# EAGLE board citizen_science_flora_RP2040 (EAGLE 9.6.2)
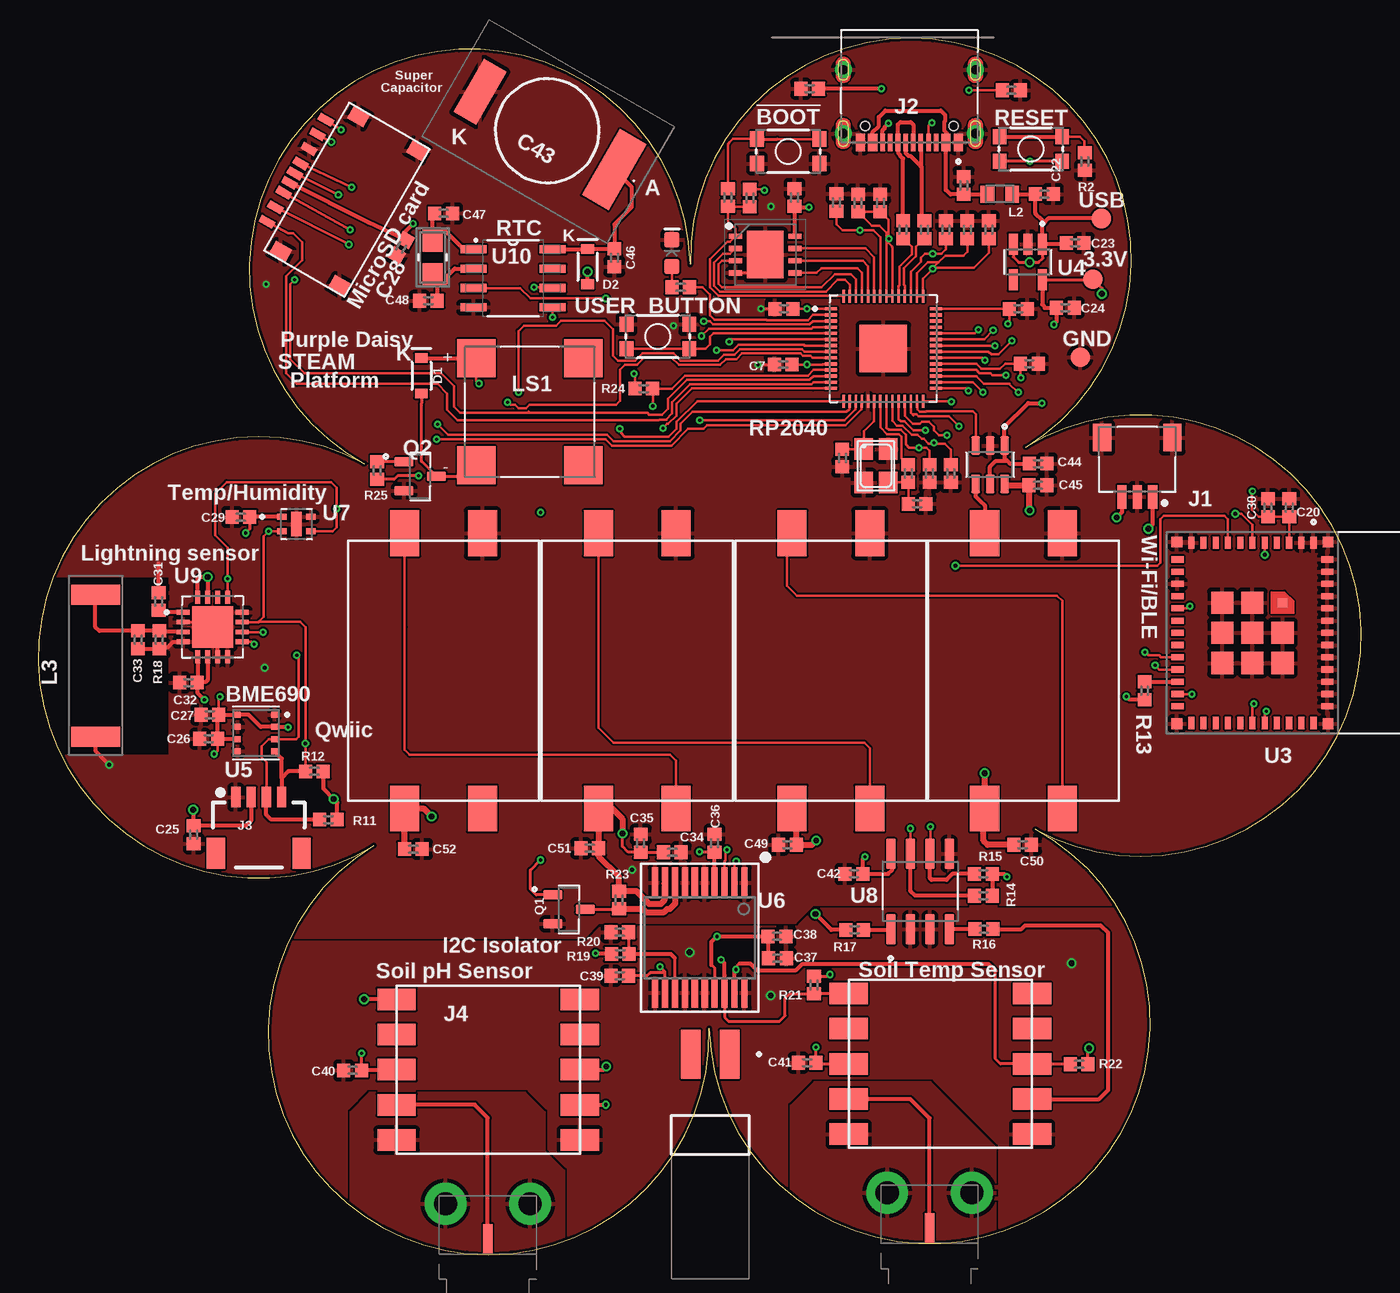
[diagram p4: board, top side]
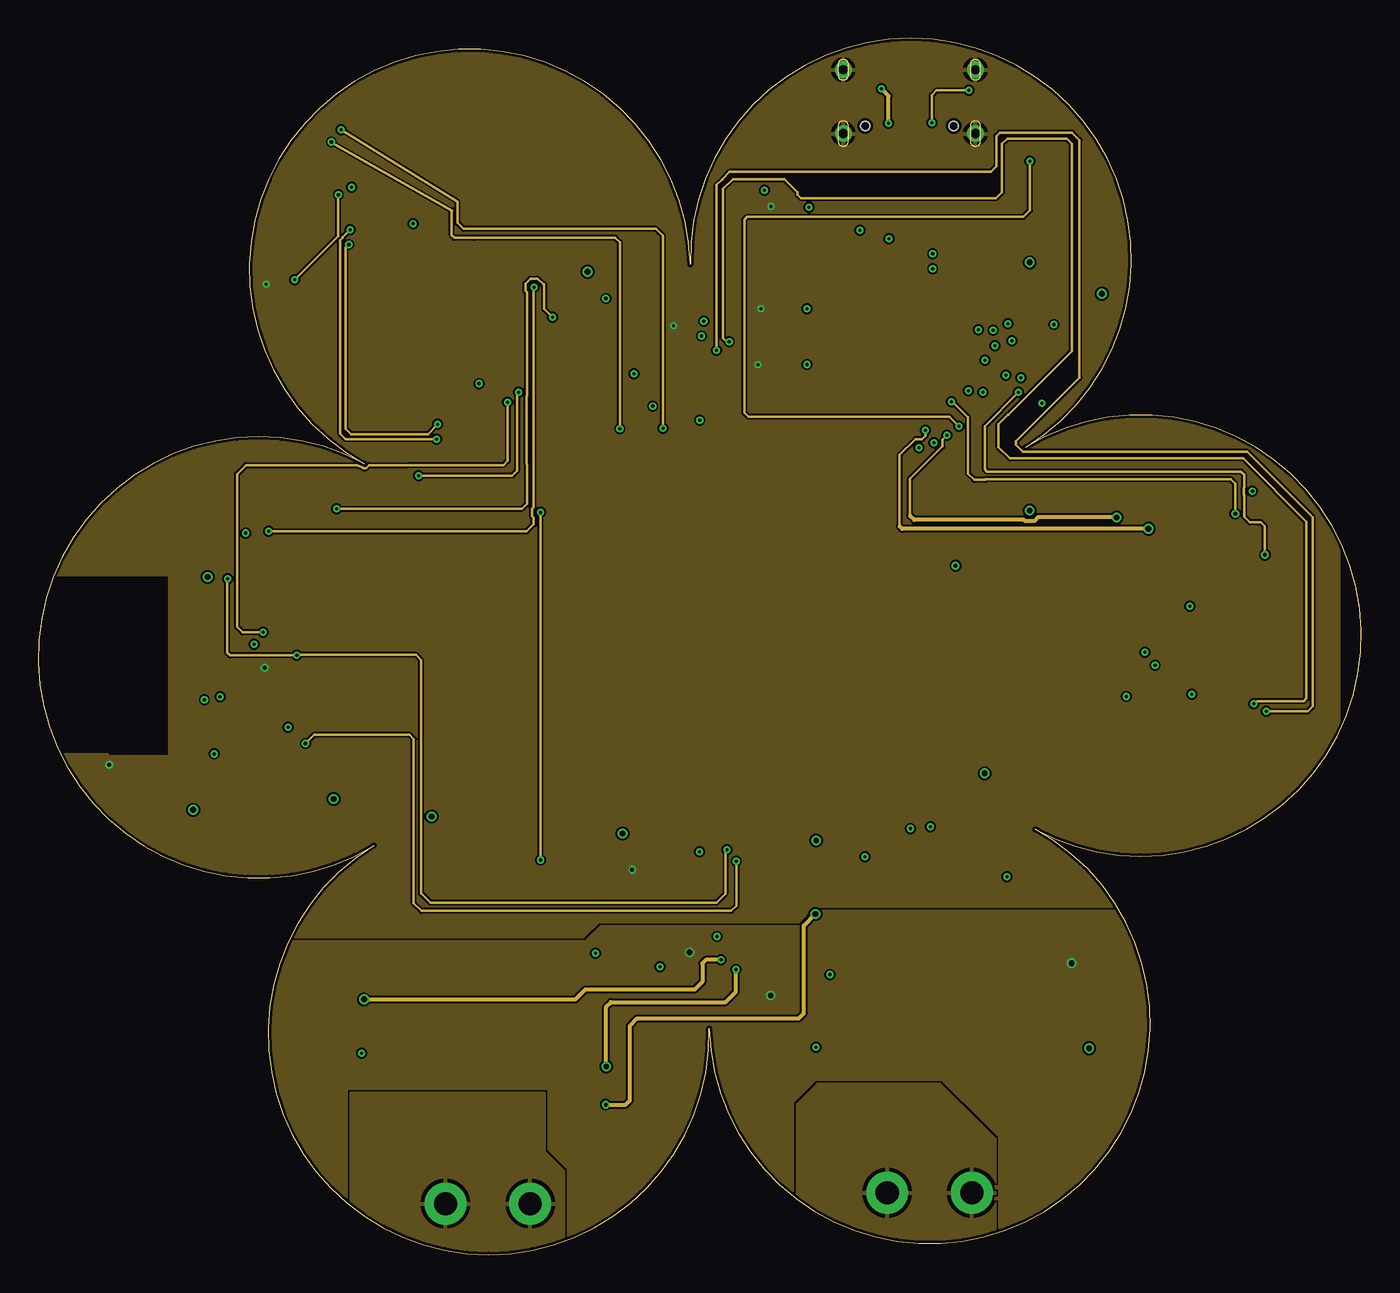
[diagram p5: board, inner layer Route2]
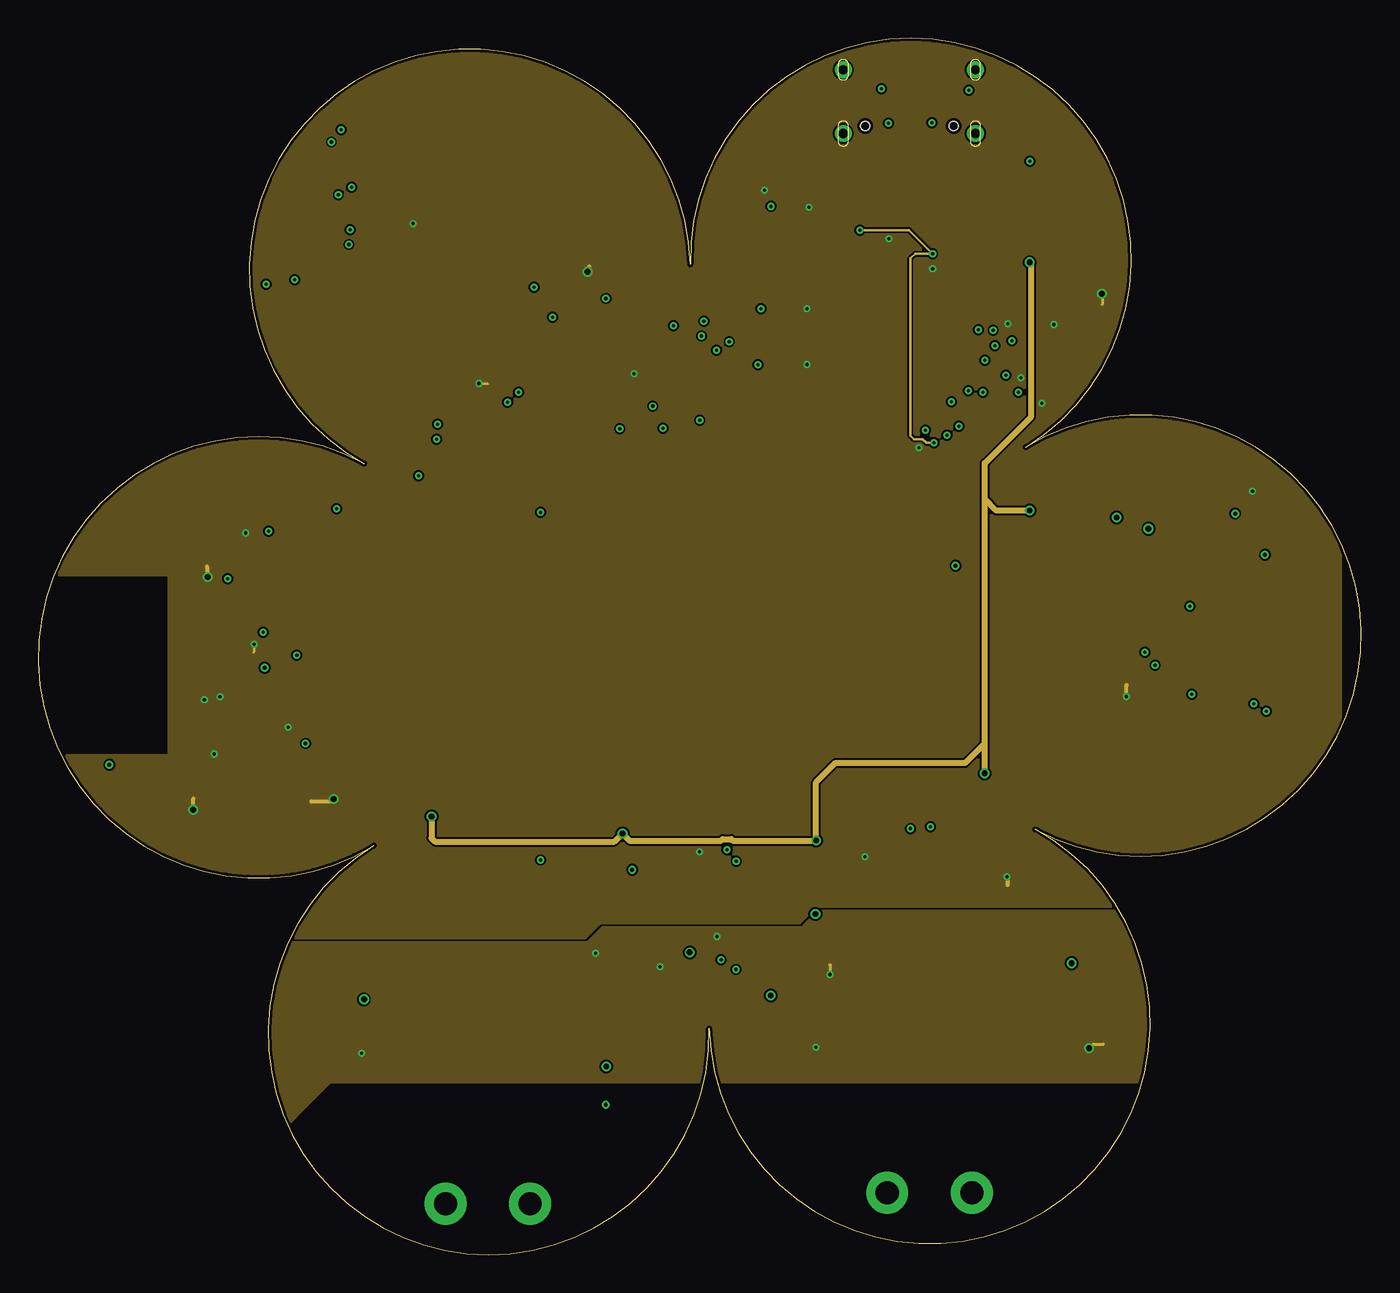
[diagram p6: board, inner layer Route15]
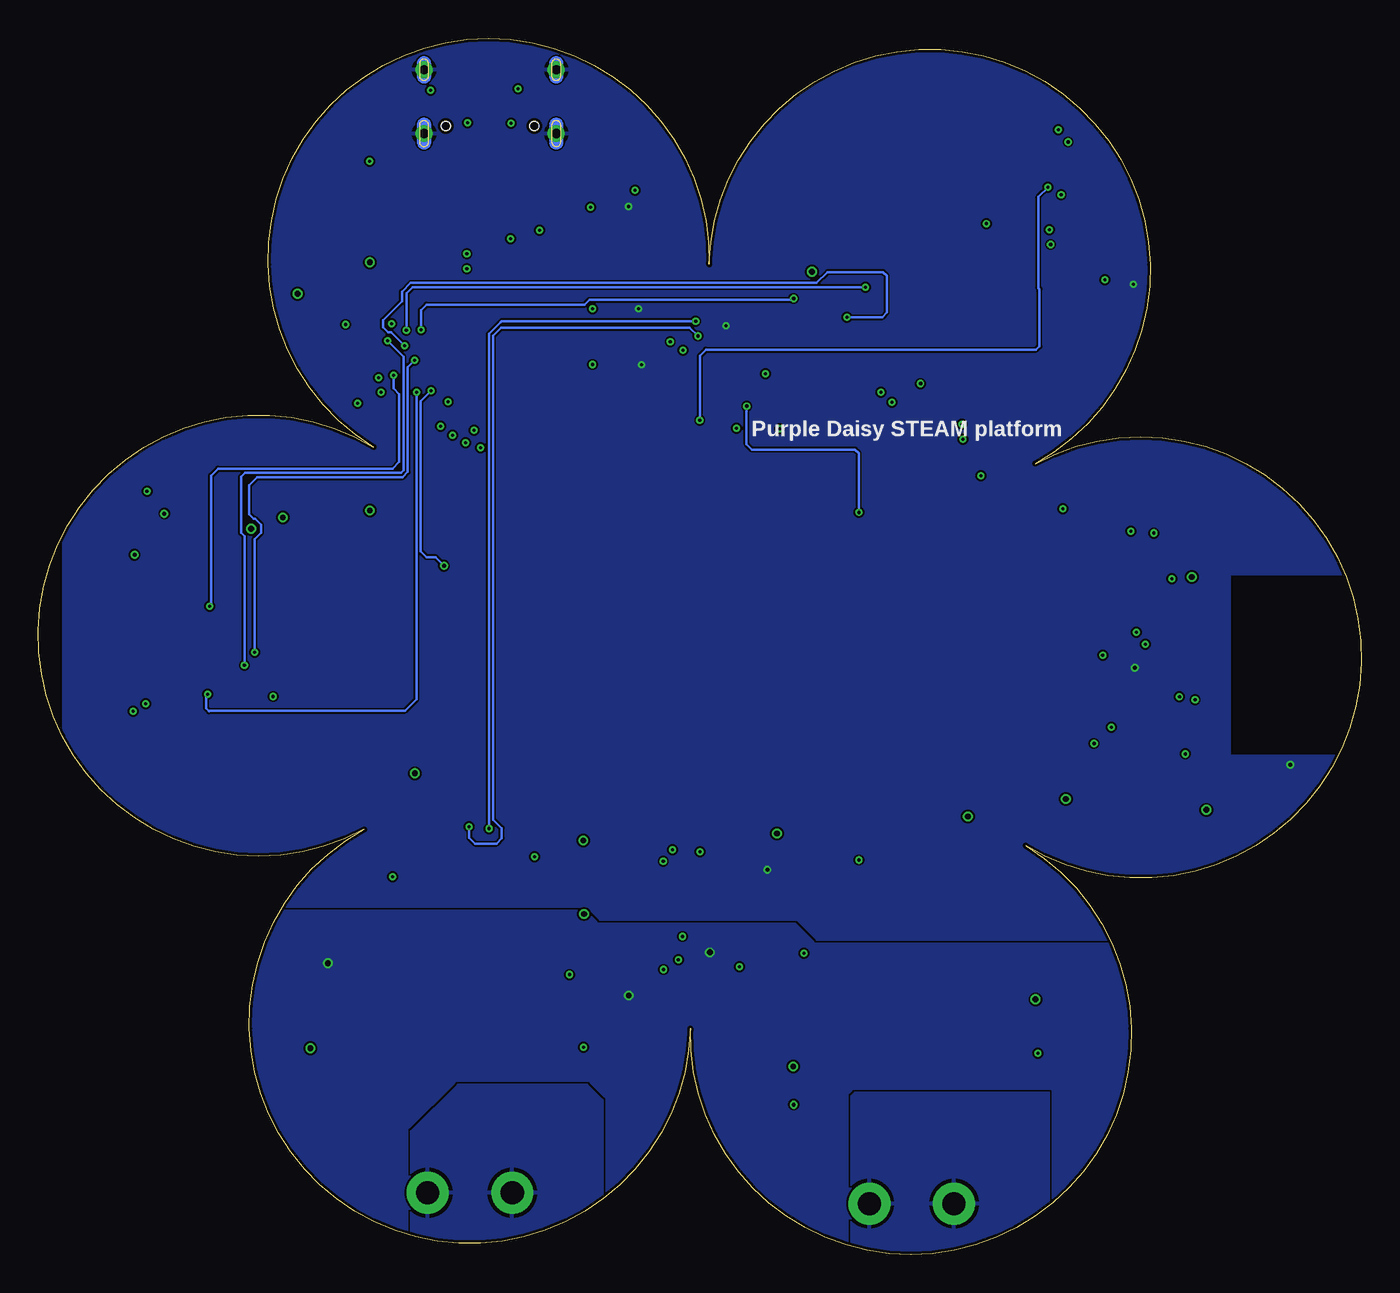
[diagram p7: board, bottom side, seen from below]

Size 86.58 x 79.57 mm. Coordinates in mm from the lower left corner, seen from the top.
Outline: 42.67,64.78 arc240 21.34,51.74 arc240 21.95,26.75 arc240 43.91,14.79 arc240 65.24,27.82 arc240 64.62,52.82 arc240 42.67,64.78
Copper layers (1+2*15+16): Top 0.035mm / dielectric 0.2mm / Route2 0.0175mm / dielectric 1.065mm / Route15 0.0175mm / dielectric 0.2mm / Bottom 0.035mm
Design rules "jlcpcb-4layers": minimum track width 3.5mil, minimum drill 0.2mm, track to track 5mil, track to pad 0.2mm, pad to pad 5mil, via to via 0.5mm, smd to smd 5mil, copper to edge 0.2mm, drill to drill 6mil, minimum pad ring 10mil, minimum via ring 0.13mm, stop-mask expansion 0.05mm, vias tented up to drill 16mil, thermal gap 10mil

## Footprints (pad centres in the part's own frame; a part is rotated, then mirrored left to right if it is on the bottom)
B1,27 = smd 1.27 x 1.27: TP 0,0
TACTILE_SWITCH_SMD_4.6X2.8MM = smd 0.9 x 1: 1 -2.05,-0.8; 2 2.05,-0.8; 3 2.05,0.8; 4 -2.05,0.8
0402 = smd 0.85 x 0.9: 1 -0.58,0; 2 0.58,0
RSCSK2043R3D01004T = smd 5 x 2: 1 0,5.075 | smd 4 x 1.7: 2 0,-5.075
SOD-323 = smd 0.63 x 0.83: A 1.15,0; C -1.15,0
LED-0603 = smd 1 x 1: A -0.877,0; C 0.877,0
SON80P400X400X50-9N = smd 0.85 x 0.35: 1 -1.95,1.2; 2 -1.95,0.4; 3 -1.95,-0.4; 4 -1.95,-1.2; 5 1.95,-1.2; 6 1.95,-0.4; 7 1.95,0.4; 8 1.95,1.2 | smd 2.4 x 3.1: 9 0,0
JST_SM03B-SRSS-TB(LF)(SN) = smd 0.6 x 1.55: 1 -1,0; 2 0,0; 3 1,0 | smd 1.2 x 1.8: S1 -2.3,-3.875; S2 2.3,-3.875
HRO_TYPE-C-31-M-12 = smd 0.6 x 1.14: A1_B12 -3.2,4.75; A4_B9 -2.4,4.75; B1_A12 3.2,4.75; B4_A9 2.4,4.75 | smd 0.3 x 1.14: A5 -1.25,4.75; A6 -0.25,4.75; A7 0.25,4.75; A8 1.25,4.75; B5 1.75,4.75; B6 0.75,4.75; B7 -0.75,4.75; B8 -1.75,4.75 | drill 0.6 pad 0.9: S1 -4.325,4.17; S2 4.325,4.17; S3 -4.325,0; S4 4.325,0 | hole 0.6: -2.89,3.68; 2.89,3.68
1X04_1MM_RA = smd 0.6 x 1.35: 1 -1.5,0; 2 -0.5,0; 3 0.5,0; 4 1.5,0 | smd 1.2 x 2: NC1 2.8,-3.675; NC2 -2.8,-3.675
60312202114511 = smd 0.61 x 1.97: 1 0,-2.325 | drill 1.52: 2 -2.77,0; 3 2.77,0
SAMTEC_TSM-102-02-S-SH = smd 1.27 x 3.18: 01 -1.27,-5.28; 02 1.27,-5.28
INDC1608X100N = smd 0.89 x 1.11: 1 -0.814,0; 2 0.814,0
MA5532-AE = smd 1.3 x 3.2: 1 -4.65,0; 2 4.65,0
XDCR_CMT-8504-100-SMT-TR = smd 2.5 x 2.5: 1 3.5,3.5; 2 3.5,-3.5; N -3.5,-3.5; P -3.5,3.5
SOT95P240X111-3N = smd 1.23 x 0.6: 1 -1.06,0.95; 2 -1.06,-0.95; 3 1.06,0
NX3225 = smd 1.4 x 1.2: 1 -1.1,-0.8; 2 1.1,-0.8; 3 1.1,0.8; 4 -1.1,0.8
QFN40P700X700X90-57N = smd 0.84 x 0.2: 1 -3.435,2.6; 2 -3.435,2.2; 3 -3.435,1.8; 4 -3.435,1.4; 5 -3.435,1; 6 -3.435,0.6; 7 -3.435,0.2; 8 -3.435,-0.2; 9 -3.435,-0.6; 10 -3.435,-1; 11 -3.435,-1.4; 12 -3.435,-1.8; 13 -3.435,-2.2; 14 -3.435,-2.6; 29 3.435,-2.6; 30 3.435,-2.2; 31 3.435,-1.8; 32 3.435,-1.4; 33 3.435,-1; 34 3.435,-0.6; 35 3.435,-0.2; 36 3.435,0.2; 37 3.435,0.6; 38 3.435,1; 39 3.435,1.4; 40 3.435,1.8; 41 3.435,2.2; 42 3.435,2.6 | smd 0.2 x 0.84: 15 -2.6,-3.435; 16 -2.2,-3.435; 17 -1.8,-3.435; 18 -1.4,-3.435; 19 -1,-3.435; 20 -0.6,-3.435; 21 -0.2,-3.435; 22 0.2,-3.435; 23 0.6,-3.435; 24 1,-3.435; 25 1.4,-3.435; 26 1.8,-3.435; 27 2.2,-3.435; 28 2.6,-3.435; 43 2.6,3.435; 44 2.2,3.435; 45 1.8,3.435; 46 1.4,3.435; 47 1,3.435; 48 0.6,3.435; 49 0.2,3.435; 50 -0.2,3.435; 51 -0.6,3.435; 52 -1,3.435; 53 -1.4,3.435; 54 -1.8,3.435; 55 -2.2,3.435; 56 -2.6,3.435 | smd 3.1 x 3.1: 57 0,0
XCVR_ESP32-C3-MINI-1-N4 = smd 0.8 x 0.4: 1 -5.9,1.3; 2 -5.9,0.5; 3 -5.9,-0.3; 4 -5.9,-1.1; 5 -5.9,-1.9; 6 -5.9,-2.7; 7 -5.9,-3.5; 8 -5.9,-4.3; 9 -5.9,-5.1; 10 -5.9,-5.9; 11 -5.9,-6.7; 25 5.9,-6.7; 26 5.9,-5.9; 27 5.9,-5.1; 28 5.9,-4.3; 29 5.9,-3.5; 30 5.9,-2.7; 31 5.9,-1.9; 32 5.9,-1.1; 33 5.9,-0.3; 34 5.9,0.5; 35 5.9,1.3 | smd 0.4 x 0.8: 12 -4.8,-7.6; 13 -4,-7.6; 14 -3.2,-7.6; 15 -2.4,-7.6; 16 -1.6,-7.6; 17 -0.8,-7.6; 18 0,-7.6; 19 0.8,-7.6; 20 1.6,-7.6; 21 2.4,-7.6; 22 3.2,-7.6; 23 4,-7.6; 24 4.8,-7.6; 36 4.8,2.2; 37 4,2.2; 38 3.2,2.2; 39 2.4,2.2; 40 1.6,2.2; 41 0.8,2.2; 42 0,2.2; 43 -0.8,2.2; 44 -1.6,2.2; 45 -2.4,2.2; 46 -3.2,2.2; 47 -4,2.2; 48 -4.8,2.2 | smd 0.6 x 0.6: 49_1 -1.975,-0.725 | smd 1.45 x 1.45: 49_2 0,-0.725; 49_3 1.975,-0.725; 49_4 1.975,-2.7; 49_5 1.975,-4.675; 49_6 0,-4.675; 49_7 -1.975,-4.675; 49_8 -1.975,-2.7; 49_9 0,-2.7 | smd 0.7 x 0.7: 50 5.95,2.25; 51 5.95,-7.65; 52 -5.95,-7.65; 53 -5.95,2.25
SOT95P280X145-5N = smd 1.39 x 0.58: 1 -1.165,0.95; 2 -1.165,0; 3 -1.165,-0.95; 4 1.165,-0.95; 5 1.165,0.95
IC_BME688 = smd 0.4 x 0.4: 1 1.2,1.2; 2 1.2,0.4; 3 1.2,-0.4; 4 1.2,-1.2; 5 -1.2,-1.2; 6 -1.2,-0.4; 7 -1.2,0.4; 8 -1.2,1.2
SSOP20 = smd 0.4 x 2: P1 -2.925,-3.6; P2 -2.275,-3.6; P3 -1.625,-3.6; P4 -0.975,-3.6; P5 -0.325,-3.6; P6 0.325,-3.6; P7 0.975,-3.6; P8 1.625,-3.6; P9 2.275,-3.6; P10 2.925,-3.6; P11 2.925,3.6; P12 2.275,3.6; P13 1.625,3.6; P14 0.975,3.6; P15 0.325,3.6; P16 -0.325,3.6; P17 -0.975,3.6; P18 -1.625,3.6; P19 -2.275,3.6; P20 -2.925,3.6
XDCR_ENS210-LQFM = smd 0.6 x 0.4: 1 -0.95,0.475; 2 -0.95,-0.475; 3 0.95,-0.475; 4 0.95,0.475 | smd 0.7 x 1.6: 5 0,0
SOIC127P599X175-8N = smd 1.97 x 0.6: 1 -2.47,1.905; 2 -2.47,0.635; 3 -2.47,-0.635; 4 -2.47,-1.905; 5 2.47,-1.905; 6 2.47,-0.635; 7 2.47,0.635; 8 2.47,1.905
QFN65P400X400X80-17N = smd 0.84 x 0.32: 1 -1.935,0.975; 2 -1.935,0.325; 3 -1.935,-0.325; 4 -1.935,-0.975; 9 1.935,-0.975; 10 1.935,-0.325; 11 1.935,0.325; 12 1.935,0.975 | smd 0.32 x 0.84: 5 -0.975,-1.935; 6 -0.325,-1.935; 7 0.325,-1.935; 8 0.975,-1.935; 13 0.975,1.935; 14 0.325,1.935; 15 -0.325,1.935; 16 -0.975,1.935 | smd 2.7 x 2.7: 17 0,0
SOIC127P600X175-8N = smd 1.702 x 0.533: 1 -2.591,1.905; 2 -2.591,0.635; 3 -2.591,-0.635; 4 -2.591,-1.905; 5 2.591,-1.905; 6 2.591,-0.635; 7 2.591,0.635; 8 2.591,1.905
OPS-S56AAF5 = smd 1.9 x 3: P$1 -2.54,-9; P$2 2.54,-9; P$3 2.54,9; P$4 -2.54,9
SOT95P280X145-6N = smd 1.21 x 0.58: 1 -1.255,0.95; 2 -1.255,0; 3 -1.255,-0.95; 4 1.255,-0.95; 5 1.255,0; 6 1.255,0.95
MICROSDCARD = smd 0.5 x 1: G1 0.2,0; P1 3.85,0; P2 2.75,0; P3 1.65,0; P4 0.9,0; P5 -0.55,0; P6 -1.65,0; P7 -2.75,0; P8 -3.85,0 | smd 0.95 x 1.2: P$1 -5.1,1.75; P$2 -5.1,6.2; P$3 5.1,6.2; P$4 5.1,1.75
PH_SENSOR = smd 2.5 x 1.4: P$1 -6,4.6; P$2 -6,2.3; P$3 -6,0; P$4 -6,-2.3; P$5 -6,-4.6; P$6 6,-4.6; P$7 6,-2.3; P$8 6,0; P$9 6,2.3; P$10 6,4.6
XTAL_FC-135_EPS = smd 1.422 x 1.295: 1 -1.092,0; 2 1.092,0

## Placement (x,y rotation side)
3.3V  TPB1,27  [B1,27]  69.02,63.81 0 top
!BOOT  MOMENTARY-SWITCH-SPST-SMD-4.6X2.8MM  [TACTILE_SWITCH_SMD_4.6X2.8MM]  49.08,72.17 0 top
C1  0.1uF  [0402]  59.72,51.09 270 top
C2  0.1uF  [0402]  52.23,68.82 90 top
C3  1.0uF  [0402]  59.39,67.04 90 top
C4  1.0uF  [0402]  60.79,67.04 90 top
C5  0.1uF  [0402]  48.8,61.86 180 top
C6  0.1uF  [0402]  62.21,67.04 90 top
C7  0.1uF  [0402]  48.75,58.22 180 top
C8  0.1uF  [0402]  64.14,61.86 0 top
C9  0.1uF  [0402]  64.85,58.27 0 top
C10  0.1uF  [0402]  53.65,68.79 90 top
C11  0.1uF  [0402]  58.32,51.09 270 top
C12  12pF  [0402]  57.51,49.1 180 top
C13  12pF  [0402]  52.61,52.1 90 top
C14  0.1uF  [0402]  55.1,68.79 90 top
C17  0.1uF  [0402]  49.49,69.15 270 top
C20  10UF0402  [0402]  81.87,48.85 90 top
C21  0.1uF  [0402]  60.56,69.93 90 top
C22  0.1uF  [0402]  65.84,69.37 0 top
C23  10UF0402  [0402]  67.85,66.17 180 top
C24  10UF0402  [0402]  67.21,61.93 180 top
C25  0.1uF  [0402]  10.17,27.46 270 top
C26  0.1uF  [0402]  11.16,33.74 180 top
C27  0.1uF  [0402]  11.23,35.31 180 top
C28  0.1uF  [0402]  23.76,65.87 240 top
C29  0.1uF  [0402]  13.27,48.24 180 top
C30  0.1uF  [0402]  80.47,48.85 90 top
C31  10UF0402  [0402]  7.88,42.73 90 top
C32  1.0uF  [0402]  9.84,37.42 180 top
C33  1nF  [0402]  6.53,40.21 270 top
C34  0.1uF  [0402]  41.48,26.32 180 top
C35  10UF0402  [0402]  39.43,26.91 270 top
C36  0.1uF  [0402]  44.25,26.91 270 top
C37  10UF0402  [0402]  48.37,19.39 0 top
C38  0.1uF  [0402]  48.34,20.81 0 top
C39  0.1uF  [0402]  38.06,18.24 180 top
C40  0.1uF  [0402]  20.58,12.05 0 top
C41  0.1uF  [0402]  50.32,12.55 0 top
C42  0.1uF  [0402]  53.37,24.9 0 top
C43  RSCSK2043R3D01004T  [RSCSK2043R3D01004T]  33.31,73.51 240 top
C44  0.1uF  [0402]  65.44,51.75 180 top
C45  0.1uF  [0402]  65.41,50.32 0 top
C46  0.1uF  [0402]  37.7,65.21 270 top
C47  12pF  [0402]  26.52,68.1 180 top
C48  12pF  [0402]  25.53,62.39 0 top
C49  0.1uF  [0402]  49.03,26.8 180 top
C50  0.1uF  [0402]  64.42,26.8 0 top
C51  0.1uF  [0402]  36.1,26.58 180 top
C52  0.1uF  [0402]  24.54,26.52 0 top
D1  1N4148  [SOD-323]  25.08,57.49 270 top
D2  1N5819  [SOD-323]  35.95,64.62 270 top
D3  [LED-0603]  41.46,65.51 90 top
GND  TPB1,27  [B1,27]  68.18,58.71 0 top
IC1  W25Q64JVXGIQ  [SON80P400X400X50-9N]  47.58,65.41 0 top
J1  SM03B-SRSS-TB(LF)(SN)  [JST_SM03B-SRSS-TB(LF)(SN)]  71.91,49.56 180 top
J2  TYPE-C-31-M-12  [HRO_TYPE-C-31-M-12]  57,77.5 180 top
J3  [1X04_1MM_RA]  14.43,29.93 0 top
J4  60312202114511  [60312202114511]  29.42,3.33 0 top
J5  60312202114511  [60312202114511]  58.32,4.05 0 top
J6  TSM-102-02-S-SH  [SAMTEC_TSM-102-02-S-SH]  43.97,7.83 180 top
L2  LQW18AN2N2D10D  [INDC1608X100N]  62.92,69.37 0 top
L3  MA5532-AE  [MA5532-AE]  3.77,38.51 90 top
LS1  MLT-8530  [XDCR_CMT-8504-100-SMT-TR]  32.16,55.12 0 top
Q1  BSS138  [SOT95P240X111-3N]  34.73,22.59 0 top
Q2  BSS138  [SOT95P240X111-3N]  25,50.91 0 top
Q3  [NX3225]  54.82,51.59 270 top
R1  27OHM0402  [0402]  57.99,67.04 90 top
R2  1K  [0402]  68.48,71.51 270 top
R3  27OHM0402  [0402]  56.6,67.04 90 top
R4  100OHM  [0402]  42.04,63.28 180 top
R5  DNF  [0402]  46.56,69.12 90 top
R6  1K  [0402]  45.14,69.15 270 top
R7  1KOHM-0402-1/16W-1%  [0402]  56.93,51.09 90 top
R9  5.1k  [0402]  50.48,76.26 0 top
R10  5.1k  [0402]  63.68,76.16 180 top
R11  DNF  [0402]  18.98,28.45 0 top
R12  2.2K  [0402]  18.07,31.6 0 top
R13  10k  [0402]  72.4,36.89 270 top
R14  1K  [0402]  61.86,23.48 0 top
R15  1K  [0402]  61.86,24.9 0 top
R16  100OHM  [0402]  61.88,21.29 180 top
R17  100OHM  [0402]  53.42,21.24 0 top
R18  10k  [0402]  7.93,40.21 90 top
R19  16.9K  [0402]  38.08,19.67 180 top
R20  10k  [0402]  38.06,21.09 0 top
R21  2.2K  [0402]  50.76,17.63 90 top
R22  2.2K  [0402]  68.1,12.45 0 top
R23  1M  [0402]  38,23.2 90 top
R24  1M  [0402]  39.63,56.65 180 top
R25  470  [0402]  22.18,51.29 270 top
RESET  MOMENTARY-SWITCH-SPST-SMD-4.6X2.8MM  [TACTILE_SWITCH_SMD_4.6X2.8MM]  64.95,72.32 0 top
U1  RP2040  [QFN40P700X700X90-57N]  55.3,59.26 0 top
U3  ESP32-C3-MINI-1-N4  [XCVR_ESP32-C3-MINI-1-N4]  82.15,40.67 270 top
U4  MIC5504-3.3YM5-T5  [SOT95P280X145-5N]  64.75,64.93 270 top
U5  BME690  [IC_BME688]  14.26,34.12 0 top
U6  ADM3260ARSZ  [SSOP20]  43.29,20.73 180 top
U7  ENS210-LQFM  [XDCR_ENS210-LQFM]  16.9,47.78 0 top
U8  SFH6325-X017TEL0631  [SOIC127P599X175-8N]  57.72,23.76 90 top
U9  AS3935-BQFT  [QFN65P400X400X80-17N]  11.41,41.05 0 top
U10  PCF8563T/F4,118  [SOIC127P600X175-8N]  31.07,63.86 0 top
U11  OPS-S56AAF5  [OPS-S56AAF5]  64.47,38.18 0 top
U12  OPS-S56AAF5  [OPS-S56AAF5]  51.87,38.18 0 top
U13  OPS-S56AAF5  [OPS-S56AAF5]  39.2,38.18 0 top
U14  OPS-S56AAF5  [OPS-S56AAF5]  26.52,38.18 0 top
U15  SN74LVC1T45DBVRG4  [SOT95P280X145-6N]  62.29,51.67 270 top
U$1  TF-123-ARP9HXX  [MICROSDCARD]  16.9,70.9 240 top
U$2  PH-OEM  [PH_SENSOR]  29.45,12.1 0 top
U$3  PH-OEM  [PH_SENSOR]  59.04,12.48 0 top
USB  V_USB  [B1,27]  69.55,67.77 0 top
USER_BUTTON  MOMENTARY-SWITCH-SPST-SMD-4.6X2.8MM  [TACTILE_SWITCH_SMD_4.6X2.8MM]  40.54,60.05 0 top
XTAL1  Q13FC1350000400  [XTAL_FC-135_EPS]  25.81,65.23 90 top

## Tracks (layer width: path | path; a pad name or v marks a point on that pad's centre or on a via)
3.3V  (via drill 0.2, 0.38)
  Top 0.152: U9.9 13.97,40.08 v14.13,39.92 | LS1.P 28.66,57.15 v28.84,56.98 | C20.1 81.74,48.27 | 81.74,48.27 C30.1 79.86,48.27 79.41,48.72 79.41,49.89 v79.46,49.94 | U3.3 81.85,48.16 81.74,48.27 | C26.1 11.74,32.97 v11.51,32.75 | C27.1 11.81,36.4 v11.89,36.48 | 55.5,66.45 U1.49 U1.48 55.9,65.89 55.87,65.92 55.87,65.96 55.63,66.2 55.63,67.68 C14.1 C10.1 54.57,67.29 55.05,67.29 55.5,66.84 55.5,66.45 | 55.5,66.45 v55.66,66.45 | 58.92,64.9 58.22,64.9 57.5,64.18 U1.44 U1.43 57.9,63.85 58.6,64.55 61.22,64.55 62.21,65.54 C6.1 | 58.92,64.9 59.36,65.34 60.54,65.34 60.79,65.59 C4.1 | U1.42 63.55,61.87 C8.1 63.56,61 v63.46,60.89 | U1.1 v50.3,61.87 49.39,61.87 C5.1 | C11.1 58.33,52.59 58.12,52.79 v57.64,52.79 56.98,52.79 56.78,52.99 56.78,53.62 56.45,53.95 55.65,53.95 55.5,54.1 U1.22 | 58.92,64.9 v58.53,64.51 v58.53,64.5 | U1.10 51.84,58.24 51.35,58.24 51.33,58.22 v50.3,58.22 C7.1 | R5.2 47.46,69.7 v47.53,69.63 | R24.2 39.05,57.56 v39,57.61 | 64.24,58.24 C9.1 | U1.33 61.39,58.27 61.71,57.94 62.94,57.94 63.28,58.27 C9.1 | C9.1 64.27,57.38 v64.29,57.36
  Top 0.203: U4.5 68.97,63.76 3.3V.TP 69.6,63.23 v69.6,62.85 | C29.1 13.85,47.48 v13.57,47.2 | C36.2 43.28,26.33 v43.26,26.35
  Top 0.254: R13.2 71.4,36.31 v71.2,36.51 | U8.8 55.89,26.15 55.89,25.18 55.61,24.9 C42.2 53.95,25.86 v54.11,26.02 | R14.2 R15.2 63.2,24.9 v63.38,24.72 | U7.1 13.78,48.26 C29.1 | U9.16 10.44,44.24 10.52,44.33 v11.08,44.33 v11.09,44.32 U9.15 | 10.44,38.81 U9.5 10.44,37.44 | 10.44,37.44 C32.1 10.42,36.77 v10.88,36.3 | U9.6 11.09,37.58 10.95,37.44 10.44,37.44 | U5.6 13.04,33.74 C26.1 11.74,35.24 C27.1 U5.8 13.77,35.32 14.57,34.52 U5.2 16.35,34.52 v16.36,34.5 | J3.2 13.93,28.39 13.59,28.04 10.35,28.04 10.17,28.23 | C25.1 10.17,28.23 | 10.17,28.23 10.17,29.06 v10.14,29.09 | D1.C 29.12,58.64 29.32,58.83 28.87,58.83 LS1.P | U$1.P4 21.6,67.52 C28.1 24.05,66.95 v24.54,67.44 | U15.5 62.29,51.54 62.67,51.92 63.41,51.92 | 63.41,51.92 63.24,52.09 U15.1 63.24,54.14 64.79,55.69 v65.67,55.69 | 63.41,51.92 63.58,51.75 C44.2 | C30.1 | R11.2 19.56,29.58 v19.34,29.8 18.65,30.49 R12.2 | D2.A v35.95,64.29 | 65.84,61.93 65.92,61.93 | 65.92,61.93 C24.2 66.64,61.02 v66.45,60.84 | U4.5 65.7,62.15 65.92,61.93 | U6.P4 C36.2 | IC1.8 49.53,68.52 C17.2 49.54,68.51 v50.43,68.51
  Route15 0.152: v14.13,39.92 14.13,39.43 14.1,39.4 | v28.84,56.98 29.39,56.98 29.42,56.95
  Route15 0.203: v69.6,62.85 69.63,62.82 69.63,62.16
  Route15 0.254: v71.2,36.51 71.2,37.22 71.23,37.24 | v11.09,44.32 11.09,44.96 11.03,45.02 | v10.14,29.09 10.14,29.83 | v19.34,29.8 19.16,29.62 17.89,29.62 | v35.95,64.29 35.95,64.52 36.05,64.62 | v63.38,24.72 63.43,24.67 63.43,24.16
  pour Route15: 1.38,20.73 1.38,32.59 1.43,32.65 8.62,32.65 8.62,34.32 8.62,44.48 7.98,44.48 -3.22,44.48 -3.22,80.32 90.28,80.32 90.28,78.9 90.28,47.35 85.17,47.35 85.17,22.79 83.22,22.79 50.88,22.79 49.79,21.7 49.33,21.7 36.94,21.7 36.91,21.72 36.73,21.72 35.74,20.73 1.43,20.73
!ESP32_BOOT  (via drill 0.2)
  Top 0.152: v75.5,36.66 74.56,36.66 U3.23 | v61.83,56.41 61.17,57.07 U1.30
  Bottom 0.152: 75.39,35.54 75.43,35.58 | 75.43,35.58 75.6,35.74 75.6,36.56 v75.5,36.66 | 75.43,35.58 62.58,35.58 61.83,36.33 v61.83,56.41
!ESP32_RST  (via drill 0.2, 0.25)
  Top 0.152: v60.03,45.07 73.24,45.07 73.44,45.27 73.44,48.11 73.67,48.34 77.62,48.34 77.85,48.11 U3.8 | v60.86,56.5 60.7,56.67 U1.29
  Bottom 0.152: 60,45.09 v60.03,45.07 60.59,45.63 61.17,45.63 61.55,46 61.55,55.82 v60.86,56.5
!QSPI_CS
  Top 0.152: R5.1 45.17,68.54 R6.2 45.14,67.6 45.63,67.11 IC1.1 45.28,66.26 45.09,66.26 43.95,65.12 43.95,63.28 44.5,62.72 49.64,62.72 49.82,62.72 52.68,62.72 U1.56
!RESET  (via drill 0.2)
  Top 0.152: U1.26 57.1,55.05 57.19,54.96 | 57.19,54.96 57.26,54.9 | 57.19,54.96 57.48,54.96 57.59,54.85 59.58,54.85 v60.25,54.18
  Top 0.203: RESET.2 v64.88,71.52 RESET.1
  Route2 0.152: v60.25,54.18 59.61,54.82 46.46,54.82 46.21,55.07 46.21,67.7 46.39,67.88 64.47,67.88 64.9,68.31 64.9,71.5 v64.88,71.52
!USB_BOOT
  Top 0.152: R6.1 45.14,72.62 45.24,72.77 45.45,72.98 47.19,72.98 47.2,72.97 | 48.37,72.97 !BOOT.3
  Top 0.203: 48.37,72.97 47.2,72.97 !BOOT.4
BUZZER_DRIVER  (via drill 0.2)
  Top 0.152: v24.89,50.96 v24.9,50.96 | 37.62,58.78 | 37.62,58.78 37.93,58.48 39.06,58.48 39.53,58.94 41.56,58.94 42.03,58.48 44.5,58.48 44.88,58.86 45.57,58.86 45.93,59.23 49.98,59.23 50.15,59.07 U1.8 | 37.62,58.78 37.62,60.54 37.07,61.09 34.23,61.09 33.89,60.76 31.78,60.76 31.43,60.41 v31.43,56.42
  Top 0.203: v24.89,50.96 v24.9,50.96 23.53,50.96 23.27,50.71 R25.2
  Route2 0.152: v31.43,56.42 31.33,56.32 31.33,51.26 31.02,50.96 v24.9,50.96
CMD  (via drill 0.2)
  Top 0.152: v26.07,53.35 37.12,53.35 37.55,52.92 41.44,52.92 42.53,54.01 43.52,54.01 43.77,54.26 52.83,54.26 53.88,55.31 53.88,55.81 U1.18 | U$1.P3 v20.4,67.04
  Route2 0.152: v26.07,53.35 20.12,53.35 19.77,53.7 19.77,66.36 19.92,66.51 19.92,66.56 v20.4,67.04
DAT0  (via drill 0.2)
  Top 0.152: v38.06,54.01 38.13,53.75 38.38,53.5 41.23,53.5 41.76,54.03 41.76,54.46 43.13,55.83 U1.15 | U$1.P7 v19.18,72.78
  Route2 0.152: 27.07,68.27 27.06,68.26 27.06,66.68 27.24,66.5 28.53,66.5 28.56,66.53 37.75,66.53 38.06,66.22 v38.06,54.01 | 27.07,68.27 27.08,68.28 | v19.18,72.78 27.07,68.27
DAT1  (via drill 0.2)
  Top 0.152: U$1.P8 v19.82,73.59 | U1.14 50.72,56.67 50.71,56.66 42.78,56.66 41.76,55.64 41.76,54.88 41.22,54.34 41.16,54.34 v40.88,54.06
  Route2 0.152: v40.88,54.06 40.88,66.63 40.42,67.09 27.85,67.09 27.44,67.49 27.44,68.87 v19.82,73.59
DAT2
  Top 0.152: U$1.P1 16.36,66.81 16.69,66.81 17.28,66.22 17.28,65.06 16.21,63.99 16.21,57.67 16.92,56.95 26.12,56.95 26.75,56.32 26.75,55.28 27.45,54.58 40.6,54.58 40.64,54.62 41.08,54.62 | 41.11,54.62 41.08,54.62 | U1.13 50.73,57.07 50.6,56.94 42.66,56.94 41.49,55.76 41.49,55.03 41.08,54.62
DAT3  (via drill 0.2)
  Top 0.152: 37.66,53.19 37.66,53.2 | 37.66,53.2 37.23,53.63 26.83,53.63 v26.14,54.31 | U$1.P2 v20.33,66.07 | 37.66,53.2 41.33,53.2 42.04,53.92 42.04,54.35 42.83,55.13 52.9,55.13 53.08,55.31 53.08,55.81 U1.16
  Route2 0.152: v26.14,54.31 25.51,53.68 20.48,53.68 20.12,54.03 20.12,65.87 v20.33,66.07
ESP32_CS  (via drill 0.2)
  Top 0.152: U3.16 75.24,42.27 v75.37,42.4 | U1.32 61.39,57.87 61.6,57.66 62.29,57.66 62.42,57.53 v63.33,57.53
  Bottom 0.152: 75.27,42.32 75.27,42.35 | 75.27,42.35 75.27,50.96 74.81,51.42 63.38,51.42 62.95,51.85 62.95,56.29 63.33,56.67 v63.33,57.53 | v75.37,42.4 75.32,42.4 75.27,42.35
ESP32_HANDSHAKE  (via drill 0.2, 0.25)
  Top 0.152: U3.6 79.45,47.74 78.72,48.47 v78.32,48.47 | U1.28 59.7,55.83 v59.75,55.79
  Route2 0.152: v78.32,48.47 78.32,50.42 78.04,50.71 61.98,50.71 61.96,50.68 61.25,50.68 60.84,51.09 60.84,54.77 59.82,55.79 v59.75,55.79
ESP32_MISO  (via drill 0.2, 0.25)
  Top 0.152: U3.5 80.25,45.8 v80.27,45.78 | U1.31 61.4,57.47 61.89,56.97 63.53,56.97 | 63.56,56.97 63.53,56.97 | v64.14,56.4 64.1,56.4 63.53,56.97
  Route2 0.152: v80.27,45.78 80.27,47.63 79.99,47.91 79.84,47.91 79.83,47.9 79.29,47.9 78.91,48.28 78.91,49.7 78.9,49.71 78.9,50.18 78.91,50.19 78.91,51 78.7,51.21 62.08,51.21 61.93,51.37 61.93,54.19 v64.14,56.4
ESP32_MOSI  (via drill 0.2)
  Top 0.152: U3.21 73.35,38.27 v73.08,38.54 | U1.35 58.76,59.04 58.78,59.06 62.18,59.06 62.36,58.88 62.82,58.88 v63.71,59.77
  Bottom 0.152: v73.08,38.54 73.08,46.99 73.3,47.21 73.3,50.87 73.03,51.14 62.85,51.14 62.67,51.32 62.67,58.73 v63.71,59.77
ESP32_RX  (via drill 0.2)
  Top 0.152: U3.30 79.45,35.96 v79.54,36.04 | U1.6 45.38,59.87 v45.22,59.7
  Route2 0.152: v79.54,36.04 79.67,36.17 79.74,36.17 79.77,36.2 82.81,36.2 82.99,36.38 82.99,47.94 78.85,52.08 63.58,52.08 62.85,52.81 62.85,54.32 63.47,54.94 67.62,59.09 67.62,72.68 67.32,72.98 63.41,72.98 63.08,72.65 63.08,69.5 62.68,69.1 49.91,69.1 49.69,69.32 49.69,69.48 48.83,70.34 45.45,70.34 44.81,69.7 44.81,59.93 45.03,59.7 v45.22,59.7
ESP32_SCK  (via drill 0.2)
  Top 0.152: U3.20 73.47,39.07 73.35,39.19 72.64,39.19 v72.42,39.4 | v61.95,58.5 61.78,58.67 U1.34
  Bottom 0.152: v72.42,39.4 72.42,46.79 72,47.21 72,47.75 72.38,48.13 72.46,48.13 72.78,48.44 72.78,50.32 72.24,50.86 62.73,50.86 62.39,51.2 62.39,58.06 v61.95,58.5
ESP32_TX  (via drill 0.2)
  Top 0.152: U3.31 80.25,35.42 v80.37,35.54 | v44.39,59.17 44.96,59.17 44.99,59.14 45.45,59.14 45.82,59.51 50.1,59.51 50.14,59.47 U1.7
  Route2 0.152: v80.37,35.54 83.06,35.54 83.4,35.87 83.4,48.22 79.1,52.51 64.45,52.51 63.99,52.97 63.99,53.22 68.13,57.36 68.13,72.91 67.65,73.39 62.92,73.39 62.69,73.16 62.69,71.18 62.34,70.82 45.24,70.82 44.76,70.34 44.39,69.97 | 44.39,69.97 44.37,69.95 | v44.39,59.17 44.39,69.97
GND  (via drill 0.2, 0.25)
  Top 0.152: U9.2 11.09,41.38 U9.17 | IC1.4 46.38,64.21 IC1.9 | C5.2 47.33,61.86 v47.3,61.88 | C7.2 48.14,58.2 v47.1,58.2
  Top 0.254: 6.51,39.66 C33.2 R18.1 8.46,39.73 8.82,40.09 9.47,40.09 U9.4 | U9.7 11.74,40.73 U9.17 | C31.2 7.88,45.22 | v4.66,32.04 3.77,32.93 L3.1
  other vias: 14.81,38.39 38.87,25.18 47.94,68.56 41.56,60.76 14.92,63.48
  pour Top: 11.54,20.73 35.74,20.73 36.71,21.7 49.54,21.7 50.73,22.89 84.46,22.89 85.1,23.53 85.1,48.6 90.2,53.7 90.2,79.2 88.98,80.42 -2.89,80.42 -3.22,80.09 -3.24,44.41 -3.24,44.38 8.62,44.38 8.62,32.62 -11.8,32.62 0.26,20.56 11.36,20.56
  pour Route2: 4.68,32.59 8.57,32.59 8.57,44.43 -3.27,44.43 -3.27,80.42 90.25,80.42 90.25,47.38 85.12,47.38 85.12,22.77 50.73,22.77 50.73,22.71 49.77,21.75 36.68,21.75 35.69,20.76 2.32,20.76 0.95,22.13 0.95,32.72 4.55,32.72
  pour Bottom: 1.38,20.73 1.38,32.65 8.59,32.65 8.59,44.51 -3.19,44.51 -3.19,80.3 90.25,80.3 90.25,47.35 85.15,47.35 85.15,22.77 50.68,22.77 49.82,21.9 36.94,21.9 35.62,20.58 1.4,20.58 1.35,20.53
GND-ISO  (via drill 0.38)
  other vias: 67.62,19.06 47.94,16.95 42.63,19.77
  pour Top (rank 2): 10.27,1.68 10.27,19.46 11.54,20.73 35.67,20.73 36.71,21.77 42.4,21.77 49.71,21.77 50.83,22.89 84.89,22.89 85.35,22.43 85.35,3.69 80.09,-1.57 13.49,-1.57 10.27,1.66
  pour Route2 (rank 2): 10.27,1.68 10.27,19.46 11.54,20.73 35.67,20.73 36.66,21.72 49.69,21.72 50.73,22.77 84.94,22.77 85.33,22.38 85.33,3.61 80.22,-1.49 8.64,-1.49 8.49,-1.34 8.49,-0.09
  pour Bottom (rank 3): 10.27,1.68 10.27,19.36 11.41,20.5 35.57,20.5 36.94,21.88 49.79,21.88 49.84,21.93 50.5,22.59 50.96,22.59 84.84,22.59 85.27,22.16 85.27,3.41 80.25,-1.62 13.57,-1.62
INT_RTC  (via drill 0.2)
  Top 0.152: U10.3 31.53,63.23 32.21,62.54 v37.14,62.54 | U1.38 61.28,60.27 v61.52,60.51
  Bottom 0.152: v61.52,60.51 61.52,61.78 61.17,62.14 50.82,62.14 50.52,62.44 37.24,62.44 v37.14,62.54
INT_SOIL  (via drill 0.2)
  Top 0.152: U8.7 v57.08,27.87 | U1.3 50.69,61.07 50.47,60.85 44.15,60.85 43.95,61.05 v43.55,61.05
  Top 0.254: R14.1 57.39,23.48 57.08,23.78 U8.7
  Bottom 0.152: v57.08,27.87 57.08,60.23 56.33,60.98 56.26,61.05 | 56.26,61.05 56.24,61.07 | v43.55,61.05 56.26,61.05
INT_SOIL_ISO  (via drill 0.25, 0.38)
  Top 0.254: U$2.P$7 37.13,9.8 v37.14,9.81 | R17.1 51.9,21.24 v50.86,22.28
  Route2 0.254: v37.14,9.81 38.44,9.81 38.72,10.09 38.72,14.97 39.2,15.45 49.77,15.45 50.1,15.78 50.1,21.52 v50.86,22.28
INT_SOILTEMP  (via drill 0.2)
  Top 0.152: v58.38,28 58.38,26.25 U8.6 | U1.4 50.68,60.67 50.59,60.57 43.89,60.57 v43.41,60.09
  Top 0.254: R15.1 59.82,24.9 59.44,24.52 58.45,24.52 58.35,24.62 U8.6
  Bottom 0.152: v58.38,28 58.38,27.26 58,26.88 56.6,26.88 56.24,27.24 56.24,27.9 56.8,28.46 56.8,60.11 56.29,60.63 43.95,60.63 v43.41,60.09
INT_SOILTEMP_ISO
  Top 0.254: U$3.P$7 69.41,10.18 70.01,10.78 70.01,21.04 69.51,21.54 64.59,21.54 64.34,21.29 R16.1
IRQ_LIGHTNING  (via drill 0.2)
  Top 0.152: v30.72,55.76 30.89,55.58 31.22,55.58 31.45,55.35 31.91,55.35 32.14,55.58 | 32.15,55.58 32.14,55.58 | U9.10 13.38,40.7 v14.71,40.7 | U1.9 50.65,58.67 50.53,58.79 50.03,58.79 49.87,58.95 46.05,58.95 45.68,58.58 45,58.58 44.61,58.2 41.92,58.2 41.45,58.67 39.64,58.67 39.18,58.2 38.38,58.2 38.08,57.89 38.08,55.86 37.8,55.58 32.14,55.58
  Route2 0.152: v30.72,55.76 30.72,51.92 30.44,51.65 24.31,51.65 24.21,51.65 21.66,51.65 21.46,51.45 21.26,51.45 21.2,51.5 20.87,51.65 13.6,51.65 13.01,51.06 13.01,41.06 13.37,40.7 v14.71,40.7
N$1
  Top 0.152: R4.2 D3.A
N$3
  Top 0.152: 68.36,72.22 R2.1 68.46,72.11 68.46,72.83 68.17,73.12 RESET.3
  Top 0.254: RESET.4 RESET.3
N$4
  Top 0.152: Q3.3 55.63,50.51 R7.1 C12.2
N$9  (via drill 0.2)
  Top 0.152: J2.A5 58.25,73.82 v58.48,74.05 | R10.2 v60.89,76.16
  Top 0.254: J2.A5
  Route2 0.152: v60.89,76.16 58.78,76.16 58.48,75.85 v58.48,74.05
N$10  (via drill 0.2)
  Top 0.152: 55.25,72.75 J2.B5
  Top 0.254: J2.B5 55.25,73.54 55.38,73.66 55.38,73.73 v55.64,74 | v55.18,76.26 R9.2
  Route2 0.254: v55.64,74 55.64,75.79 v55.18,76.26
N$11
  Top 0.203: L2.1 62.21,69.48
  Top 0.254: J2.B4_A9 54.6,73.43 55,73.82 55,74.4 55.43,74.84 59.06,74.84 59.34,74.56 59.34,74.16 59.27,74.08 59.27,73.56 59.42,73.41 59.42,72.77 J2.A4_B9 59.39,72.74 59.39,69.65 59.69,69.35 C21.1 62.09,69.35 L2.1
N$12
  Top 0.152: U3.22
  Top 0.254: R13.1 U3.22
N$13
  Top 0.254: U8.4 59.64,21.27 61.28,21.27 R16.2
N$14
  Top 0.254: R17.2 55.77,21.24 U8.1
N$15
  Top 0.254: U9.1 8,42.03 C31.1
N$16
  Top 0.254: U9.3 7.94,40.73 R18.2 C33.1 4,40.8 3.74,41.05 3.74,43.14 L3.2
N$17
  Top 0.203: R20.2 38.66,21.06 R19.1 | U6.P13 41.66,19.39
  Top 0.254: R19.1 41.38,19.67 41.66,19.39
N$22
  Top 0.152: U11.P$2 67.01,42.76 66.66,43.11 49.64,43.11 49,43.75 49,46.85 U12.P$4
N$23
  Top 0.152: U12.P$2 54.41,33.13 54.06,33.48 37.65,33.48 36.66,34.47 U13.P$4
N$24
  Top 0.152: U13.P$2 41.74,32.32 41.36,32.7 24.31,32.7 23.98,33.03 23.98,41.05 U14.P$4
N$26
  Top 0.152: 25.08,55.2 25.08,55.68 D1.A
  Top 0.203: LS1.N 27.95,50.91 Q2.3 25.08,51.89 25.08,53.75 25.08,55.68 D1.A
  Top 0.254: 28.63,51.66 LS1.N
N$27
  Top 0.203: Q2.1 22.19,51.86 R25.1
N$28
  Top 0.254: U10.8 D2.C 35.96,65.79 C46.1 37.7,67.39 38.82,68.51 38.82,69.86 C43.1
N$29
  Top 0.254: C48.2 26.11,63.84 XTAL1.1 26.37,63.58 26.45,63.49 26.62,63.49 26.7,63.58 26.7,63.94 27.26,64.5 U10.2
N$30
  Top 0.254: XTAL1.2 25.81,66.89 | 25.81,66.89 25.81,67.97 C47.2 | 25.81,66.89 26.37,66.89 26.45,66.97 26.62,66.97 27.83,65.77 U10.1
NEOPIXEL_3.3V
  Top 0.152: U1.27 57.53,55.81 57.53,55.31 57.7,55.13 58.1,55.13 58.12,55.15 61.17,55.15 61.35,54.97 61.35,52.94 U15.3
NEOPIXEL_5V
  Top 0.254: U15.4 61.34,49.6 61.67,49.27 61.93,49 U11.P$4
PDIS
  Top 0.203: Q1.3 37.98,22.59 R23.1
  Top 0.406: R23.1 39.56,22.62 39.78,22.4 40.95,22.4 41.17,22.62 41.34,22.62 41.69,22.97 41.69,24.31 U6.P8
PDIS_EN  (via drill 0.2)
  Top 0.152: U1.11 50.73,57.87 50.37,57.5 42.33,57.5 41.49,56.65 40.37,56.65 | 40.37,56.65 R24.1 | v40.22,55.51 40.22,56.5 40.37,56.65
  Top 0.203: Q1.1 32.58,23.54 32.21,23.91 32.21,25.15 v32.87,25.81
  Route2 0.152: v32.87,25.81 v32.87,48.55
  Bottom 0.152: v32.87,48.55 32.87,52.41 33.13,52.66 39.86,52.66 40.22,53.02 v40.22,55.51
PRB1
  Top 0.152: U$2.P$4 25.49,9.8 25.51,9.81
  Top 0.254: J4.1 29.42,8.95 28.56,9.81 25.51,9.81 24.09,9.81 24.01,9.74
PRB1_GND
  pour Top: 20.43,-0.86 20.43,9.3 21.7,10.57 31.86,10.57 33.13,9.3 33.13,6.76 34.4,5.49 34.4,0.41 33.13,-0.86
  pour Route2: 19.16,0.41 20.43,1.68 20.43,10.57 33.13,10.57 33.13,6.76 34.4,5.49 34.4,4.22 34.4,0.41 33.13,-0.86 20.43,-0.86
  pour Bottom (rank 2): 20.43,0.41 20.43,10.57 33.13,10.57 33.36,10.34 33.36,5.21 33.36,0.06 31.76,-1.54 22.38,-1.54
PROBE2
  Top 0.254: J5.1 58.33,8.92 57.07,10.18 U$3.P$4
PROBE2_GND
  pour Top: 49.26,-0.4 49.26,9.73 50.78,11.26 58.38,11.26 62.62,7.02 62.62,-0.04 61.14,-1.52 50.37,-1.52
  pour Route2: 49.64,0.41 49.64,9.84 50.98,11.18 59.01,11.18 61.68,8.52 62.62,7.58 62.62,-1.19 51.16,-1.19 49.56,0.41 49.61,0.41
  pour Bottom (rank 2): 49.64,-0.86 49.64,10.09 50.65,11.11 59.11,11.11 62.16,8.06 62.16,-0.3 61.42,-1.03 49.84,-1.03 49.69,-0.88 49.66,-0.88
QSPI_SCLK
  Top 0.152: 49.58,65.06 49.63,65.01 53.96,65.01 54.3,64.66 U1.52
  Top 0.203: 49.58,65.06 IC1.6
QSPI_SD0
  Top 0.152: U1.53 53.9,64.22 53.6,64.52 51.24,64.52 50.93,64.21 IC1.5
QSPI_SD1
  Top 0.152: IC1.2 45.28,65.46 44.8,65.46 44.23,64.89 44.23,63.39 44.62,63 51.54,63 52.31,63.76 52.8,63.76 53.1,63.46 U1.55
QSPI_SD2
  Top 0.152: IC1.3 44.74,65.01 44.51,64.78 44.51,63.51 44.74,63.28 51.26,63.28 52.13,64.14 53.17,64.14 53.5,63.81 U1.54
QSPI_SD3
  Top 0.152: U1.51 54.7,65.25 54.14,65.81 IC1.7
SCL  (via drill 0.2)
  Top 0.152: U10.6 33.61,63.28 v32.44,63.28 | U9.11 14.43,41.38 | 14.43,41.38 14.76,41.71 14.76,47 v15.08,47.31 U7.2 | U6.P2 45.56,25.62 v45.68,25.74 | R12.1 v17.49,33.43 17.49,41.02 17.13,41.38 14.43,41.38 | v62.49,60.46 61.9,59.87 58.75,59.87 U1.37
  Top 0.254: R12.1 16.36,31.6 15.93,31.17 | 15.93,31.17 J3.4 | 15.93,31.17 15.93,32.44 U5.4
  Route2 0.152: v32.44,63.28 32.42,63.25 32.42,48.88 32.31,48.78 32.31,48.31 32.42,48.21 32.42,47.76 31.97,47.31 v15.08,47.31 | v45.68,25.74 45.68,22.82 45.35,22.49 25.08,22.49 24.57,22.99 24.57,33.71 24.29,33.99 18.05,33.99 v17.49,33.43
  Bottom 0.152: v32.44,63.28 62.08,63.28 62.49,62.88 v62.49,60.46
SCL_ISO  (via drill 0.2, 0.38)
  Top 0.152: U6.P19 45.56,18.56 v45.65,18.65
  Top 0.203: R22.1 65.06,12.45 U$3.P$8 62.97,12.48 62.64,12.81 62.64,18.55 | 45.56,18.72 45.9,19.06
  Top 0.254: U$2.P$8 37.01,12.1 37.17,12.25 v37.17,12.3 | U6.P19 45.56,18.72 | 45.9,19.06 46.59,19.06 47.04,18.61 49.6,18.61 50.01,19.02 62.17,19.02 62.64,18.55
  Route2 0.254: v37.17,12.3 37.17,16.21 37.47,16.52 44.96,16.52 45.65,17.2 v45.65,18.65
SD_CLK  (via drill 0.2)
  Top 0.152: v20.5,69.83 U$1.P5 | U1.17 53.48,55.81 53.48,55.31 52.74,54.57 v43.29,54.57
  Bottom 0.152: v20.5,69.83 20.48,69.81 21.11,69.18 21.11,63.2 21.06,63.15 21.06,59.42 21.29,59.19 42.88,59.19 43.29,58.78 v43.29,54.57
SDA  (via drill 0.2)
  Top 0.152: U10.5 v33.66,61.32 | J3.3 14.93,32.22 14.61,32.54 14.61,33.26 15.08,33.72 U5.3 16.88,33.72 17.05,33.89 17.05,39.07 v16.92,39.2 | U9.13 v12.39,44.2 12.39,46.25 11.59,47.05 11.59,49.79 12.33,50.53 19.16,50.53 19.54,50.15 v19.54,48.8 19.54,47.58 19.26,47.3 17.86,47.3 U7.3 | U6.P3 44.91,25.72 44.98,25.79 44.98,26.4 v45.06,26.49 | v62.59,59.44 58.76,59.44 U1.36
  Top 0.254: R11.1 15.25,28.46 14.92,28.79 14.92,29.91 J3.3
  Route2 0.152: v33.66,61.32 33.11,61.88 33.11,63.46 33.06,63.46 32.68,63.84 32.21,63.84 31.88,63.51 31.88,63.05 31.99,62.94 31.99,56.19 31.96,56.16 31.96,51.72 31.99,51.7 31.99,49.13 31.66,48.8 v19.54,48.8 | v12.39,44.2 12.38,44.19 12.38,39.38 12.55,39.2 v16.92,39.2 16.95,39.22 24.72,39.22 25.05,38.89 25.05,23.63 25.66,23.02 44.38,23.02 44.97,23.61 44.97,26.58 v45.06,26.49
  Bottom 0.152: v33.66,61.32 31.35,61.32 31.05,61.63 31.05,64.02 31.3,64.27 34.93,64.27 35.64,63.56 62.2,63.56 62.77,62.99 62.77,62.38 64.02,61.12 64.02,60.66 63.69,60.33 63.61,60.33 63.48,60.33 v62.59,59.44
SDA_ISO  (via drill 0.2, 0.38)
  Top 0.203: U$3.P$1 50.78,17.08 | 50.78,17.08 R21.1 | U6.P18 44.91,15.53 45.17,15.27 48.52,15.27 48.88,15.63 48.88,16.77 49.18,17.08 50.78,17.08
  Top 0.254: U$2.P$1 v21.32,16.7 v21.32,16.69 | U6.P18 44.91,18.27 44.9,18.28 44.9,19.07 v44.69,19.28
  Route2 0.254: v21.32,16.69 35.16,16.69 35.8,17.33 39.1,17.33 39.22,17.33 42.96,17.33 43.47,17.84 43.47,19.06 43.69,19.28 v44.69,19.28
SWCLK  (via drill 0.2, 0.38)
  Top 0.152: 56.33,55.81 U1.24 56.3,54.65 56.45,54.51 56.68,54.51 57.27,53.92 v58.06,53.92
  Top 0.254: J1.1 72.91,47.74 v72.65,47.48
  Route2 0.152: 56.37,47.66 56.37,52.31 57.41,53.35 57.84,53.35 58.06,53.57 v58.06,53.92
  Route2 0.254: v72.65,47.48 56.55,47.48 56.37,47.66
SWD  (via drill 0.2, 0.38)
  Top 0.152: v59.47,53.6 58.93,53.6 58.62,53.91 58.62,54.15 58.29,54.48 57.83,54.48 57.71,54.36 57.24,54.36 56.73,54.87 56.73,55.81 U1.25
  Top 0.254: J1.3 70.91,48.56 v70.57,48.22
  Route2 0.152: v59.47,53.6 59.17,53.3 59.17,52.87 57.06,50.75 57.06,48.34
  Route2 0.254: v70.57,48.22 65.41,48.22 65.17,47.97 64.59,47.97 64.5,48.06 57.33,48.06 57.06,48.34
SWITCH  (via drill 0.2)
  Top 0.152: v16.77,63.76 16.49,63.47 16.49,58.58 17.43,57.64 26.37,57.64 27.21,56.8 27.21,55.46 27.59,55.07 32.03,55.07 | 16.92,70.6 U$1.G1 v19.64,69.32 19.66,69.32 | 32.03,55.07 32.08,55.13 | 32.03,55.07 39.86,55.07 39.98,54.94 40.82,54.94 41.21,55.33 41.21,55.97 42.45,57.22 50.48,57.22 50.73,57.47 U1.12
  Route2 0.152: v16.77,63.76 19.64,66.62 v19.64,69.32
USB_N
  Top 0.254: 56.78,72.73 J2.A7 | J2.B7 57.75,72.46 57.73,72.44 57.74,72.43 | R1.2 57.81,67.8 57.81,71.13 | J2.A7 56.78,72.73 | J2.A7 56.75,72.45 56.73,72.42 | J2.B7 57.73,72.73 | 57.81,71.13 57.81,71.14 57.1,71.86 56.97,71.86 56.78,72.05 56.78,72.21 56.76,72.24 56.73,72.24 | 56.73,72.24 56.73,72.3 | J2.B7 57.75,71.19 57.81,71.13 | J2.A7 56.73,72.78 56.73,72.83 | J2.A7 56.75,72.26 56.73,72.24
USB_P
  Top 0.203: 56.25,72.8 56.25,72.81 56.28,72.83
  Top 0.254: J2.A6 57.26,73.92 57.11,74.07 56.42,74.07 56.25,73.91 56.25,72.8 J2.B6 56.25,72.24 | 56.23,72.41 56.28,72.45 56.28,72.83 | 56.62,67.62 R3.2 56.6,71.69 56.4,71.89 56.4,71.93 56.28,72.05 56.28,72.24 | 56.23,72.22 56.25,72.24 | 56.25,72.24 56.28,72.24 | 56.28,72.24 56.28,72.42
USBIN_N
  Top 0.152: U1.46 56.7,63.36 56.64,63.43 56.64,64.51 57.45,65.32 57.45,65.94 57.97,66.46 R1.1
USBIN_P
  Top 0.152: R3.1 56.62,66.46 57.17,65.91 57.17,65.43 56.36,64.62 56.36,63.41 56.3,63.35 U1.47
USR_BUTTON
  Top 0.152: USER_BUTTON.1 USER_BUTTON.2 42.61,59.24 43.67,59.24 43.97,59.54 43.97,60.05 44.19,60.27 U1.5
USR_LED
  Top 0.152: U1.2 50.69,61.47 50.36,61.13 47.68,61.13 47.67,61.14 44.25,61.14 43.95,61.45 43.95,62.8 43.47,63.28 R4.1
V_USB  (via drill 0.38)
  Top 0.203: USB.TP 69.55,68.13 | 65.78,66.17 U4.1 65.74,66.05 65.74,65.18 65.46,64.9 v64.88,64.9 64.17,64.9 63.8,65.27 U4.3 | C34.2 C35.2 38.61,26.33 38.23,26.7 v38.23,27.54
  Top 0.254: L2.2 C22.1 65.26,68.1 65.7,67.66 65.7,67.37 | 65.7,67.37 U4.1 67.19,66.09 C23.2 | USB.TP 66.11,67.77 65.7,67.37
  Top 0.406: v61.93,31.48 U11.P$1 61.86,29.11 61.86,27.08 62.14,26.8 C50.1 | U12.P$1 49.61,28.91 C49.1 50.63,26.8 v50.91,27.08 | v38.23,27.54 38.23,28.51 37.56,29.18 U13.P$1 36.68,29.16 C51.1 36.68,26.07 38.01,24.75 R23.2 39.15,23.78 40,22.93 40.73,22.93 40.97,23.17 40.97,24.29 U6.P9 | C52.1 23.96,29.16 U14.P$1 25.21,29.18 v25.74,28.66 | U15.6 63.33,50.32 C45.1 64.83,48.72 v64.88,48.67
  Route15 0.406: v61.93,31.48 61.93,33.43 | 61.93,33.43 61.93,49.41 | 61.93,33.43 60.66,32.16 52.18,32.16 50.91,30.89 v50.91,27.08 45.44,27.08 45.35,27.17 44.78,27.17 44.69,27.08 38.69,27.08 v38.23,27.54 37.7,27.01 25.97,27.01 25.74,27.24 v25.74,28.66 | v64.88,48.67 62.67,48.67 61.93,49.41 | 61.93,49.41 61.93,51.77 64.98,54.82 64.98,64.8 v64.88,64.9
VCC-ISO  (via drill 0.2, 0.38)
  Top 0.203: U6.P12 41.01,18.51 | 47.89,20.58 47.8,20.75 C38.1 | R21.2 51.69,18.21 v51.8,18.32 | U$3.P$3 50.9,12.48 C41.2 50.9,13.55 v50.88,13.57 | R22.2 68.68,13.41 v68.76,13.49 | 44.02,19 44.06,18.96 44.26,18.75 U6.P17 | 41.01,18.51 40.94,18.44 40.04,18.44 39.85,18.24 C39.1 | 41.01,18.51 v40.7,18.83 | C40.2 v21.16,13.16 v21.17,13.16
  Top 0.254: U$2.P$3 23.39,12.05 C40.2 | 44.06,18.96 44.06,20.46 v44.41,20.81 47.61,20.81 | 47.61,20.81 47.74,20.81 47.8,20.75 | C37.1 47.79,20.63 47.61,20.81 | R19.2 36.53,19.67 v36.48,19.72
  Route15 0.203: v51.8,18.32 51.85,18.37 51.85,18.93 51.8,18.93 | v68.76,13.49 69.04,13.77 69.73,13.77
  pour Route15 (rank 2): 10.27,6.76 10.27,19.46 11.54,20.73 35.97,20.73 36.81,21.57 49.66,21.57 50.78,22.69 85.05,22.69 85.33,22.41 85.33,11.64 84.94,11.26 19.13,11.26 14.71,6.84 10.34,6.84
VOUT  (via drill 0.2)
  Top 0.152: U1.50 55.1,66.55 54.64,67.01 v53.78,67.01 52.61,67.01 52.23,67.39 C2.1 | U1.45 57.1,64.29 57.77,64.95 57.77,65.21 58.02,65.46 v58.53,65.46 59.09,65.46 59.39,65.77 C3.1 | C1.1 59.72,52.66 59.34,53.04 58.53,53.04 | U1.23 55.89,55.81 55.89,54.54 56.2,54.23 56.57,54.23 57.16,53.64 57.55,53.64 57.83,53.35 57.95,53.35 58.26,53.04 58.53,53.04 | 58.53,53.04 58.59,53.1 v58.61,53.1
  Route15 0.152: v53.78,67.01 55.43,67.01 55.43,67.02 56.98,67.02 v58.53,65.46 57.39,65.46 57.08,65.16 57.08,53.58 57.31,53.35 57.88,53.35 58.13,53.1 v58.61,53.1
XIN
  Top 0.152: U1.20 54.7,54.53 54.02,53.84 54.02,52.71 | 54.02,52.71 Q3.1 | C13.2 53.99,52.68 54.02,52.71
XOUT
  Top 0.152: R7.2 56.5,52.1 56.5,53.51 56.33,53.67 55.54,53.67 55.1,54.11 U1.21

## Text on the board
tPlace: K | A | K | K
tNames: Super | Capacitor | MicroSD card | RTC | Purple Daisy | STEAM | Platform | RP2040 | Temp/Humidity | Wi-Fi/BLE | Lightning sensor | BME690 | Qwiic | I2C Isolator | Soil pH Sensor | Soil Temp Sensor
bNames: Purple Daisy STEAM platform